# Altium schematic sheet USB2514_hubs_1.SchDoc
size A3
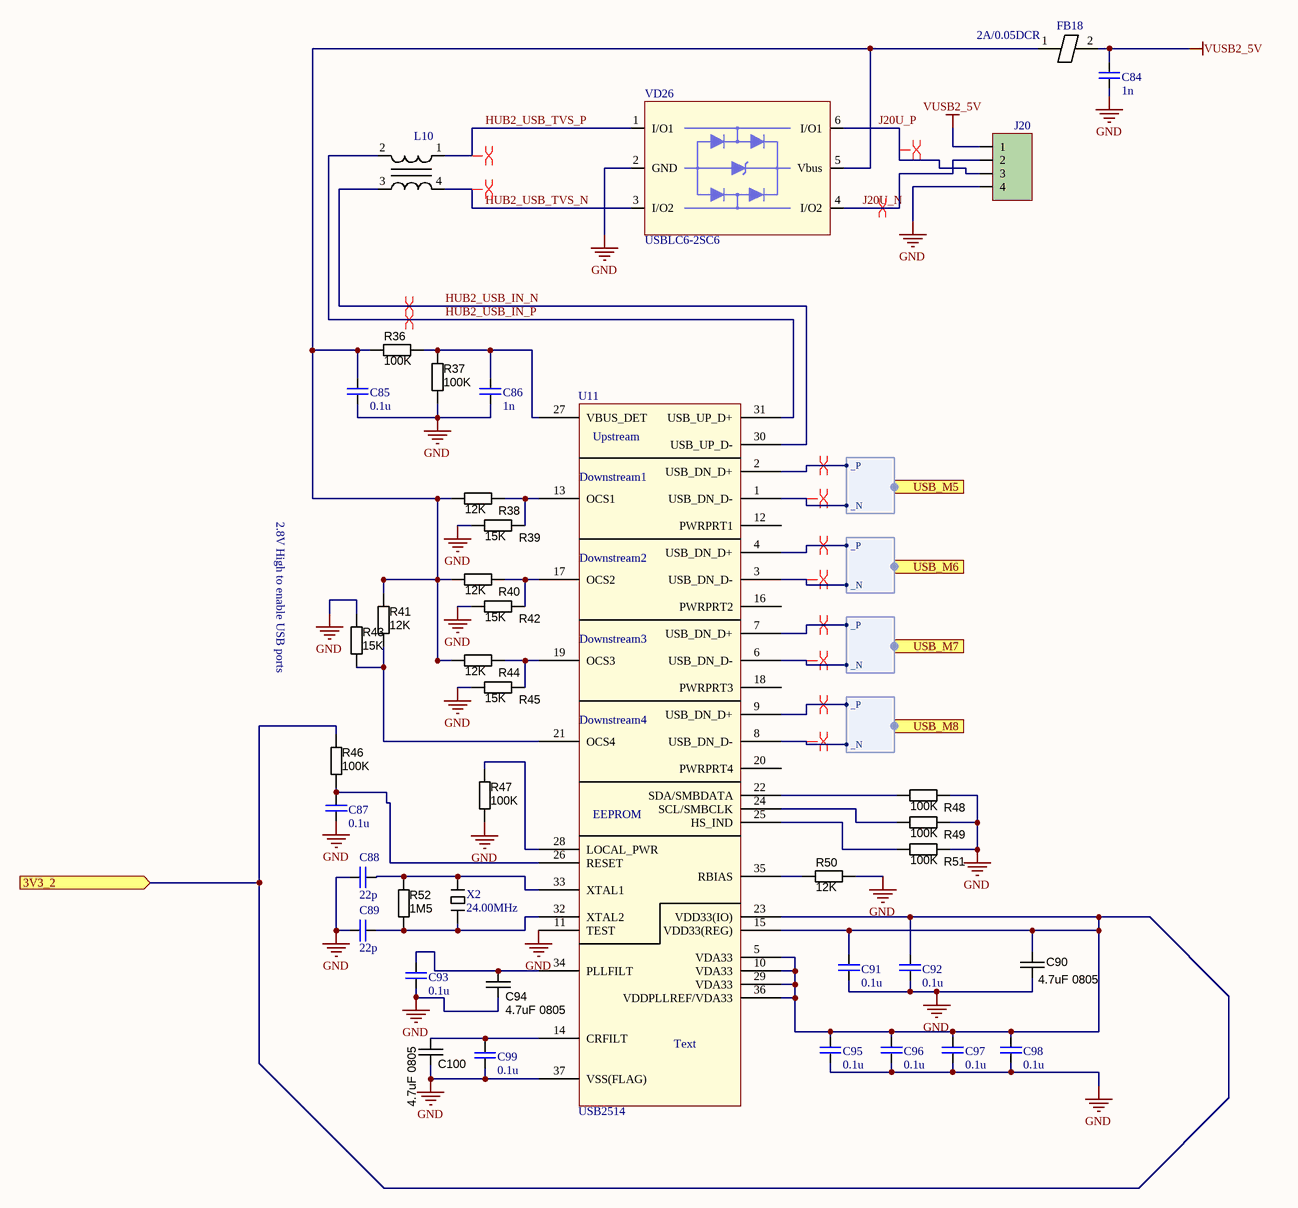
[diagram p0: USB2514_hubs_1.SchDoc]

## Parts
C84  value 1n  [C0402]  (hidden comment: Конденсатор SMD, 1нФ, X7R, 25В, 10%, 0402)
C85  value 0.1u  [C0402]  (hidden comment: Конденсатор SMD, 0.1мкФ, X7R, 25В, 10%, 0402)
C86  value 1n  [C0402]  (hidden comment: Конденсатор SMD, 1нФ, X7R, 25В, 10%, 0402)
C87  value 0.1u  [C0402]  (hidden comment: Конденсатор SMD, 0.1мкФ, X7R, 25В, 10%, 0402)
C88  value 22p  [C0402]  (hidden comment: Конденсатор SMD, 22пФ, X7R, 50В, 10%, 0402)
C89  value 22p  [C0402]  (hidden comment: Конденсатор SMD, 22пФ, X7R, 50В, 10%, 0402)
C90  value 4.7uF 0805  [CAPC2012X135N]  (hidden comment: approved sub OK)
C91  value 0.1u  [C0402]  (hidden comment: Конденсатор SMD, 0.1мкФ, X7R, 25В, 10%, 0402)
C92  value 0.1u  [C0402]  (hidden comment: Конденсатор SMD, 0.1мкФ, X7R, 25В, 10%, 0402)
C93  value 0.1u  [C0402]  (hidden comment: Конденсатор SMD, 0.1мкФ, X7R, 25В, 10%, 0402)
C94  value 4.7uF 0805  [CAPC2012X135N]  (hidden comment: approved sub OK)
C95  value 0.1u  [C0402]  (hidden comment: Конденсатор SMD, 0.1мкФ, X7R, 25В, 10%, 0402)
C96  value 0.1u  [C0402]  (hidden comment: Конденсатор SMD, 0.1мкФ, X7R, 25В, 10%, 0402)
C97  value 0.1u  [C0402]  (hidden comment: Конденсатор SMD, 0.1мкФ, X7R, 25В, 10%, 0402)
C98  value 0.1u  [C0402]  (hidden comment: Конденсатор SMD, 0.1мкФ, X7R, 25В, 10%, 0402)
C99  value 0.1u  [C0402]  (hidden comment: Конденсатор SMD, 0.1мкФ, X7R, 25В, 10%, 0402)
C100  value 4.7uF 0805  [CAPC2012X135N]  (hidden comment: approved sub OK)
FB18  2A/0.05DCR  [RESC2012X70N]
J20  Разъём (вилка), CWF-4 (DS1069-4 M)  [CWF-4]  (value not drawn)
L10  Inductor ESD (Choke)  [EMI Choke Murata]  (value not drawn)
R36  value 100K  [RESC1005X40N]  (hidden comment: Thick Film)
R37  value 100K  [RESC1005X40N]  (hidden comment: Thick Film)
R38  value 12K  [RESC1005X40N]  (hidden comment: Thick Film)
R39  value 15K  [RESC1005X40N]  (hidden comment: Thick Film)
R40  value 12K  [RESC1005X40N]  (hidden comment: Thick Film)
R41  value 12K  [RESC1005X40N]  (hidden comment: Thick Film)
R42  value 15K  [RESC1005X40N]  (hidden comment: Thick Film)
R43  value 15K  [RESC1005X40N]  (hidden comment: Thick Film)
R44  value 12K  [RESC1005X40N]  (hidden comment: Thick Film)
R45  value 15K  [RESC1005X40N]  (hidden comment: Thick Film)
R46  value 100K  [RESC1005X40N]  (hidden comment: Thick Film)
R47  value 100K  [RESC1005X40N]  (hidden comment: Thick Film)
R48  value 100K  [RESC1005X40N]  (hidden comment: Thick Film)
R49  value 100K  [RESC1005X40N]  (hidden comment: Thick Film)
R50  value 12K  [RESC1005X40N]  (hidden comment: Thick Film)
R51  value 100K  [RESC1005X40N]  (hidden comment: Thick Film)
R52  value 1M5  [RESC1005X40N]  (hidden comment: Thick Film)
U11  USB2514  [USB-2514B 4port Hub]
VD26  TVS Diode  [SOT23-6L]  (value not drawn)
X2  24.00MHz  [Quartz SMD KX-K]

## Ports
3V3_2 (in), USB_M5 (harness DIFF), USB_M6 (harness DIFF), USB_M7 (harness DIFF), USB_M8 (harness DIFF)

## Harnesses
DIFF: _P, _N

## Nets
GND: C84.2 C85.2 C86.2 C87.2 C88.1 C89.1 C90.2 C91.2 C92.2 C93.2 C94.2 C95.2 C96.2 C97.2 C98.2 C99.2 C100.2 J20.4 R37.2 R39.1 R42.1 R43.1 R45.1 R47.2 R48.2 R49.2 R50.2 R51.2 U11.11(TEST) U11.37(VSS(FLAG)) VD26.2(GND)
VUSB2_5V: C84.1 FB18.2 J20.1
3V3_2: C90.1 C91.1 C92.1 C95.1 C96.1 C97.1 C98.1 R46.1 U11.5(VDA33) U11.10(VDA33) U11.15(VDD33(REG)) U11.23(VDD33(IO)) U11.29(VDA33) U11.36(VDDPLLREF/VDA33) ; port 3V3_2
HUB2_USB_IN_N: L10.3 U11.30(USB_UP_D-)
HUB2_USB_IN_P: L10.2 U11.31(USB_UP_D+)
HUB2_USB_TVS_N: L10.4 VD26.3(I/O2)
HUB2_USB_TVS_P: L10.1 VD26.1(I/O1)
J20U_N: J20.2 VD26.4(I/O2)
J20U_P: J20.3 VD26.6(I/O1)
NetC85_1: C85.1 FB18.1 R36.1 R38.1 R40.1 R41.1 R44.1 VD26.5(Vbus)
NetC86_1: C86.1 R36.2 R37.1 U11.27(VBUS_DET)
NetC87_1: C87.1 R46.2 U11.26(RESET)
NetC88_2: C88.2 R52.1 U11.33(XTAL1) X2.2
NetC89_2: C89.2 R52.2 U11.32(XTAL2) X2.1
NetC93_1: C93.1 C94.1 U11.34(PLLFILT)
NetC99_1: C99.1 C100.1 U11.14(CRFILT)
NetR38_2: R38.2 R39.2 U11.13(OCS1)
NetR40_2: R40.2 R42.2 U11.17(OCS2)
NetR41_2: R41.2 R43.2 U11.21(OCS4)
NetR44_2: R44.2 R45.2 U11.19(OCS3)
NetR47_1: R47.1 U11.28(LOCAL_PWR)
NetR48_1: R48.1 U11.22(SDA/SMBDATA)
NetR49_1: R49.1 U11.24(SCL/SMBCLK)
NetR50_1: R50.1 U11.35(RBIAS)
NetR51_1: R51.1 U11.25(HS_IND)
NetU11_1: U11.1(USB_DN_D-) ; port USB_M5._N
NetU11_2: U11.2(USB_DN_D+) ; port USB_M5._P
NetU11_3: U11.3(USB_DN_D-) ; port USB_M6._N
NetU11_4: U11.4(USB_DN_D+) ; port USB_M6._P
NetU11_6: U11.6(USB_DN_D-) ; port USB_M7._N
NetU11_7: U11.7(USB_DN_D+) ; port USB_M7._P
NetU11_8: U11.8(USB_DN_D-) ; port USB_M8._N
NetU11_9: U11.9(USB_DN_D+) ; port USB_M8._P

Not connected (* = marked no-connect by the designer): U11 12(PWRPRT1) 16(PWRPRT2) 18(PWRPRT3) 20(PWRPRT4)

## Layout directives
differential pair: HUB2_USB_IN_N, HUB2_USB_IN_P, HUB2_USB_TVS_N, HUB2_USB_TVS_P, J20U_N, J20U_P, NetU11_1, NetU11_2, NetU11_3, NetU11_4, NetU11_6, NetU11_7, NetU11_8, NetU11_9

## Notes on the sheet
- 2.8V High to enable USB ports
- (in symbol SMSC USB2514) Upstream; Downstream1; Downstream2; Downstream3; Downstream4; EEPROM; Text

## Library data of the parts
C84 C86 = C0402: Chip Capacitor 0402; Assembly: 1n_X7R_25V_10%_0402; Voltage_assembly: 25V; Tolerance: 10%; Voltage: 25В; TemperatureCoeff: X7R; Family: Конденсатор SMD; Capacitance: 1нФ; Package: 0402
C85 C87 C91-C93 C95-C99 = C0402: Chip Capacitor 0402; Assembly: 0.1u_X7R_25V_10%_0402; Voltage_assembly: 25V; Tolerance: 10%; Voltage: 25В; TemperatureCoeff: X7R; Family: Конденсатор SMD; Capacitance: 0.1мкФ; Package: 0402
C88 C89 = C0402: Chip Capacitor 0402; Assembly: 22p_X7R_50V_10%_0402; Voltage_assembly: 50V; Tolerance: 10%; Voltage: 50В; TemperatureCoeff: X7R; Family: Конденсатор SMD; Capacitance: 22пФ; Package: 0402
C90 C94 C100 = CAPC_4u7_0805: Capacitor SMD Cer 4.7uF 10% 16V X5R 0805; Manufacturer 1: Taiyo Yuden; Manufacturer Part Number 1: EMK212BJ475KG-T; Ratings: 16V; X5R; Material: ceramic; SCDType: spec; Package / Case: 0805 (2012 Metric); Tolerance: ±10%; Supplier 1: Digi-Key; Supplier Part Number 1: 587-1294-1-ND; Operating Temperature: -55°C ~ 85°C; Size / Dimension: 0.079" L x 0.049" W (2.00mm x 1.25mm); Thickness (Max): 0.053" (1.35mm); ComponentLink1URL: http://www.yuden.co.jp/productdata/catalog/en/mlcc01_e.pdf; ComponentLink1Description: http://www.yuden.co.jp/productdata/catalog/en/mlcc01_e.pdf; Supplier 2: Digi-Key; Supplier Part Number 2: 1276-1065-1-ND; Manufacturer 2: Samsung Electro-Mechanics America, Inc; Manufacturer Part Number 2: CL21A475KOFNNNE; RoHS 2: RoHS Compliant; ComponentLink2URL: http://www.samsungsem.com/servlet/FileDownload?type=spec&file=CL21A475KOFNNNE.pdf; ComponentLink2Description: http://www.samsungsem.com/servlet/FileDownload?type=spec&file=CL21A475KOFNNNE.pdf; Supplier 3: Digi-Key; Supplier Part Number 3: 399-8101-1-ND; Manufacturer 3: Kemet; Manufacturer Part Number 3: C0805C475K4PACTU; RoHS 3: RoHS Compliant; ComponentLink3URL: http://capacitoredge.kemet.com/capedge2/DataSheet?pn=C0805C475K4PACTU; ComponentLink3Description: http://capacitoredge.kemet.com/capedge2/DataSheet?pn=C0805C475K4PACTU; Supplier 4: Digi-Key; Supplier Part Number 4: 490-7215-1-ND; Manufacturer 4: Murata Electronics North America; Manufacturer Part Number 4: GRM21BR61C475MA88L; RoHS 4: RoHS Compliant; ComponentLink4URL: http://psearch.murata.com/capacitor/product/GRM21BR61C475MA88#.pdf; ComponentLink4Description: http://psearch.murata.com/capacitor/product/GRM21BR61C475MA88#.pdf; Supplier 5: Digi-Key; Supplier Part Number 5: 445-7640-1-ND; Manufacturer 5: TDK Corporation; Manufacturer Part Number 5: C2012X5R1C475K125AC; RoHS 5: RoHS Compliant; ComponentLink5URL: http://product.tdk.com/capacitor/mlcc/en/documents/mlcc_commercial_general_en.pdf; ComponentLink5Description: http://product.tdk.com/capacitor/mlcc/en/documents/mlcc_commercial_general_en.pdf; RoHS 1: RoHS Compliant
FB18 = Ferrite Bead 2A/0.05DCR
J20 = CWF-4: 4-pin male though-hole connector, pitch 2.5 mm; Manufacturer: Confly (China); Family: Разъём (вилка); PartNumber: CWF-4 (DS1069-4 M); Assembly: CWF-4; Value: CWF-4
L10 = Inductor ESD (Choke): DLW21HN900SQ2L
R36 R37 R46 R47 = RES_100K_0402_5%: Resistor SMD chip 100k Ohm 0.063W 5% 0402; Manufacturer 1: Vishay Dale; Manufacturer Part Number 1: CRCW0402100KJNED; Ratings: 1/16 W; SCDType: undef; Package / Case: 0402 (1005 Metric); Tolerance: ±5%; ComponentLink2URL: http://www.yageo.com/documents/recent/PYu-RC0402_51_RoHS_L_6.pdf; ComponentLink2Description: http://www.yageo.com/documents/recent/PYu-RC0402_51_RoHS_L_6.pdf; Supplier 1: Digi-Key; Supplier Part Number 1: 541-100KJCT-ND; ComponentLink1URL: http://www.vishay.com/doc?20035; ComponentLink1Description: http://www.vishay.com/doc?20035; Supplier 2: Digi-Key; Supplier Part Number 2: 311-100KJRCT-ND; Manufacturer 2: Yageo; Manufacturer Part Number 2: RC0402JR-07100KL
R38-R45 R48-R51 = RES_1K_0402_5%: Resistor SMD chip 1k Ohm 0.063W 5% 0402; Manufacturer 1: Yageo; Manufacturer Part Number 1: RC0402JR-071KL; Ratings: 1/16 W; SCDType: spec; Package / Case: 0402 (1005 Metric); Tolerance: ±5%; Supplier 1: Digi-Key; Supplier Part Number 1: 311-1.0KJRCT-ND; RoHS 1: RoHS Compliant; ComponentLink1URL: http://www.yageo.com/documents/recent/PYu-RC0402_51_RoHS_L_6.pdf; ComponentLink1Description: http://www.yageo.com/documents/recent/PYu-RC0402_51_RoHS_L_6.pdf; Supplier 2: Digi-Key; Supplier Part Number 2: 541-1.0KJCT-ND; Manufacturer 2: Vishay Dale; Manufacturer Part Number 2: CRCW04021K00JNED; RoHS 2: RoHS Compliant; ComponentLink2URL: http://www.vishay.com/doc?20035; ComponentLink2Description: http://www.vishay.com/doc?20035; Supplier 3: Digi-Key; Supplier Part Number 3: 1276-4376-1-ND; Manufacturer 3: Samsung Electro-Mechanics America, Inc; Manufacturer Part Number 3: RC1005J102CS; RoHS 3: RoHS Compliant; ComponentLink3URL: http://www.samsungsem.com/servlet/FileDownload?filename=productcatalog/pdf/Chip_Resistor.pdf; ComponentLink3Description: http://www.samsungsem.com/servlet/FileDownload?filename=productcatalog/pdf/Chip_Resistor.pdf; Supplier 4: Digi-Key; Supplier Part Number 4: RHM1.0KCECT-ND; Manufacturer 4: Rohm Semiconductor; Manufacturer Part Number 4: MCR01MRTJ102; RoHS 4: RoHS Compliant; ComponentLink4URL: http://rohmfs.rohm.com/en/products/databook/datasheet/passive/resistor/chip_resistor/mcr_g.pdf; ComponentLink4Description: http://rohmfs.rohm.com/en/products/databook/datasheet/passive/resistor/chip_resistor/mcr_g.pdf; Supplier 5: Digi-Key; Supplier Part Number 5: P1.0KJCT-ND; Manufacturer 5: Panasonic Electronic Components; Manufacturer Part Number 5: ERJ-2GEJ102X; RoHS 5: RoHS Compliant; ComponentLink5URL: http://industrial.panasonic.com/www-cgi/jvcr13pz.cgi?E+PZ+3+AOA0001+ERJ2GEJ102X+7+WW; ComponentLink5Description: http://industrial.panasonic.com/www-cgi/jvcr13pz.cgi?E+PZ+3+AOA0001+ERJ2GEJ102X+7+WW
R52 = RES_1M_0402_5%: Resistor SMD chip 1M Ohm 0.063W 5% 0402; Manufacturer 1: Vishay Dale; Manufacturer Part Number 1: CRCW04021M00JNED; Ratings: 1/16 W; Power Rating: 0.063W, 1/16W; SCDType: spec; Package / Case: 0402 (1005 Metric); Tolerance: ±5%; Material: Thick Film; Manufacturer 2: Yageo; Manufacturer Part Number 2: RC0402JR-071ML; Supplier 1: Digi-Key; Supplier Part Number 1: 541-1.0MJCT-ND; ComponentLink1URL: http://www.vishay.com/doc?20035; ComponentLink1Description: http://www.vishay.com/doc?20035; Supplier 2: Digi-Key; Supplier Part Number 2: 311-1.0MJRCT-ND; ComponentLink2URL: http://www.yageo.com/documents/recent/PYu-RC0402_51_RoHS_L_6.pdf; ComponentLink2Description: http://www.yageo.com/documents/recent/PYu-RC0402_51_RoHS_L_6.pdf
U11 = SMSC USB2514: type: USB2514
VD26 = USBLC6-2SC6: Very low capacitance ESD protection; Manufacturer: STMicroelectronics; Part Number: USBLC6-2SC6
X2 = Quartz: Quartz KX-K